# Altium project UCM Updated.PrjPcb
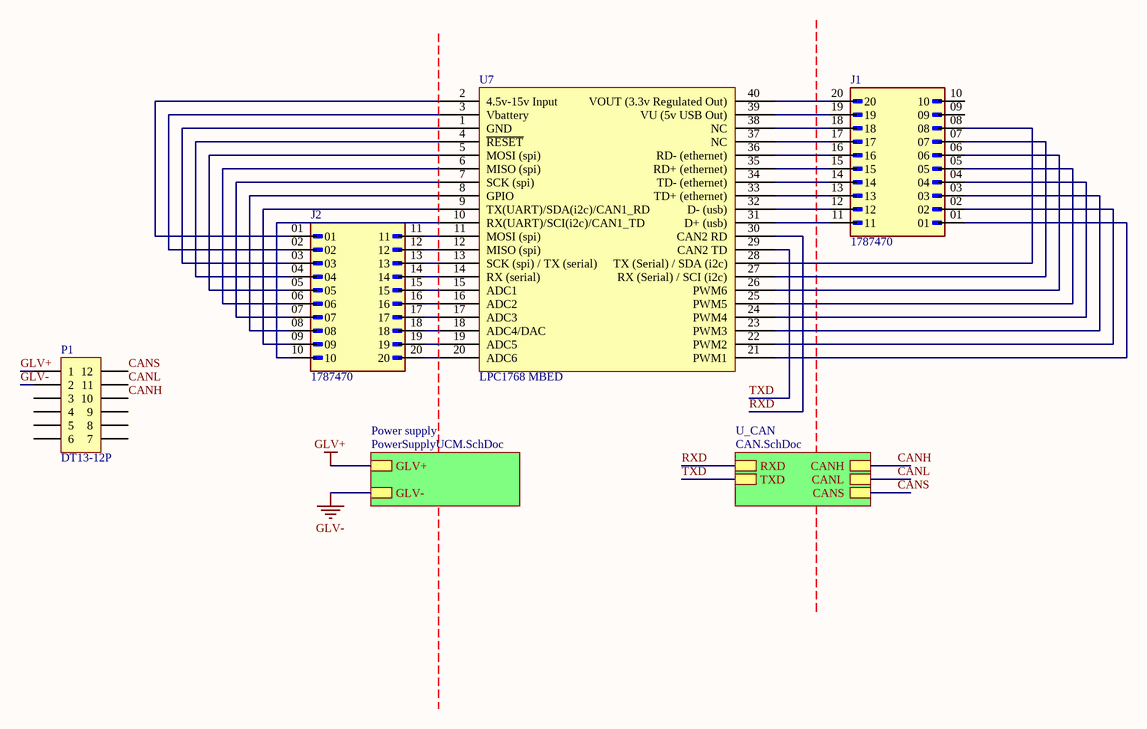
[diagram p0: toplayerUCM.SchDoc]
3 sheets, 50 parts. Net scope: hierarchical (ports join the sheet entries above them; power ports are global).
Board file: UCM update.PcbDoc
Sheets:
  toplayerUCM.SchDoc
    U_CAN = CAN.SchDoc
    Power supply = PowerSupplyUCM.SchDoc

## Sheet toplayerUCM.SchDoc
size A4; SheetNumber: 1; SheetTotal: 4

### Parts
J1  1787470  [PHOENIX_1787470]
J2  1787470  [PHOENIX_1787470]
P1  DT13-12P  [DT13-12P]
U7  LPC1768 MBED  [LPC1768 MBED]

### Sub-sheets
Power supply = PowerSupplyUCM.SchDoc: GLV+, GLV-
U_CAN = CAN.SchDoc: RXD, TXD, CANH, CANL, CANS

### Nets
GLV+: P1.1 ; sheet Power supply/GLV+
GLV-: P1.2 ; sheet Power supply/GLV-
CANH: P1.10 ; sheet U_CAN/CANH
CANL: P1.11 ; sheet U_CAN/CANL
CANS: P1.12 ; sheet U_CAN/CANS
RXD: U7.30(CAN2_RD) ; sheet U_CAN/RXD
TXD: U7.29(CAN2_TD) ; sheet U_CAN/TXD
NetJ1_01: J1.01 U7.21(PWM1)
NetJ1_02: J1.02 U7.22(PWM2)
NetJ1_03: J1.03 U7.23(PWM3)
NetJ1_04: J1.04 U7.24(PWM4)
NetJ1_05: J1.05 U7.25(PWM5)
NetJ1_06: J1.06 U7.26(PWM6)
NetJ1_07: J1.07 U7.27(RX_(Serial)_/_SCI_(i2c))
NetJ1_08: J1.08 U7.28(TX_(Serial)_/_SDA_(i2c))
NetJ1_11: J1.11 U7.31(D+_(usb))
NetJ1_12: J1.12 U7.32(D-_(usb))
NetJ1_13: J1.13 U7.33(TD+_(ethernet))
NetJ1_14: J1.14 U7.34(TD-_(ethernet))
NetJ1_15: J1.15 U7.35(RD+_(ethernet))
NetJ1_16: J1.16 U7.36(RD-_(ethernet))
NetJ1_17: J1.17 U7.37(NC)
NetJ1_18: J1.18 U7.38(NC)
NetJ1_19: J1.19 U7.39(VU_(5v_USB_Out))
NetJ1_20: J1.20 U7.40(VOUT_(3.3v_Regulated_Out))
NetJ2_01: J2.01 U7.2(4.5v-15v_Input)
NetJ2_02: J2.02 U7.3(Vbattery)
NetJ2_03: J2.03 U7.1(GND)
NetJ2_04: J2.04 U7.4(~{RESET})
NetJ2_05: J2.05 U7.5(MOSI_(spi))
NetJ2_06: J2.06 U7.6(MISO_(spi))
NetJ2_07: J2.07 U7.7(SCK_(spi))
NetJ2_08: J2.08 U7.8(GPIO)
NetJ2_09: J2.09 U7.9(TX(UART)/SDA(i2c)/CAN1_RD)
NetJ2_10: J2.10 U7.10(RX(UART)/SCI(i2c)/CAN1_TD)
NetJ2_11: J2.11 U7.11(MOSI_(spi))
NetJ2_12: J2.12 U7.12(MISO_(spi))
NetJ2_13: J2.13 U7.13(SCK_(spi)_/_TX_(serial))
NetJ2_14: J2.14 U7.14(RX_(serial))
NetJ2_15: J2.15 U7.15(ADC1)
NetJ2_16: J2.16 U7.16(ADC2)
NetJ2_17: J2.17 U7.17(ADC3)
NetJ2_18: J2.18 U7.18(ADC4/DAC)
NetJ2_19: J2.19 U7.19(ADC5)
NetJ2_20: J2.20 U7.20(ADC6)

Not connected (* = marked no-connect by the designer): J1 09 10; P1 3 4 5 6 7 8 9

### Library data of the parts
P1 = DT13-12P[[/\]]DT13-12P: Positions: 12; Pitch: 4.44mm; Row Spacing: 6.35mm; Angle: 90; Flange: Yes; Contact: Nickel; Part Number: DT13-12P; Digikey Part Number: 1734-1451-ND; Digikey Link: https://www.digikey.com.au/product-detail/en/te-connectivity-deutsch-connectors/DT13-12PA/1734-1451-ND/7220123
U7 = LPC1768 MBED: ARM M3 mBed Enabled Microcontroller; Manufacturer: NXP; Part Number: LPC1768 MBED; Digikey Part Number: 568-4916-ND; Digikey Link: https://www.digikey.com/product-detail/en/nxp-usa-inc/OM11043,598/568-4916-ND/2138502
J1 J2 = 1787470: Package: None; Price: None; Value: *; MP: 1787470; Availability: Unavailable

## Sheet CAN.SchDoc
size A4; SheetNumber: 2; SheetTotal: 3
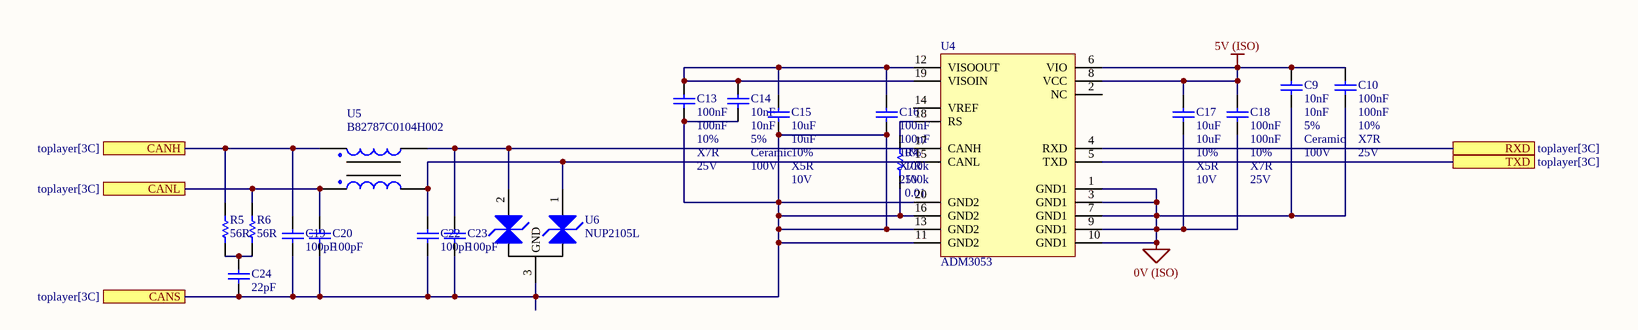
[diagram p1: CAN.SchDoc]

### Parts
C9  10nF  Tolerance: 5%  Material: Ceramic  Rated Voltage: 100V  [1206]
C10  100nF  Tolerance: 10%  Material: X7R  Rated Voltage: 25V  [0805]
C13  100nF  Tolerance: 10%  Material: X7R  Rated Voltage: 25V  [0805]
C14  10nF  Tolerance: 5%  Material: Ceramic  Rated Voltage: 100V  [1206]
C15  10uF  Tolerance: 10%  Material: X5R  Rated Voltage: 10V  [0805]
C16  100nF  Tolerance: 10%  Material: X7R  Rated Voltage: 25V  [0805]
C17  10uF  Tolerance: 10%  Material: X5R  Rated Voltage: 10V  [0805]
C18  100nF  Tolerance: 10%  Material: X7R  Rated Voltage: 25V  [0805]
C19  100pF  [0805]
C20  100pF  [0805]
C22  100pF  [0805]
C23  100pF  [0805]
C24  22pF  [0805]
R4  100k  Tolerance: 0.01  [0805]
R5  56R  [0805]
R6  56R  [0805]
U4  ADM3053  [AD SOIC-W 20]
U5  B82787C0104H002  [TDK 4-PC Pad]
U6  NUP2105L  [ON SOT-23]

### Ports
CANH (see toplayer[3C]), CANL (see toplayer[3C]), CANS (see toplayer[3C]), RXD (see toplayer[3C]), TXD (see toplayer[3C])

### Nets
0V (ISO): C9.1 C10.1 C17.1 C18.1 U4.1(GND1) U4.3(GND1) U4.7(GND1) U4.9(GND1) U4.10(GND1)
5V (ISO): C9.2 C10.2 C17.2 C18.2 U4.6(VIO) U4.8(VCC)
CANH: C19.2 R5.2 U5.1 ; port CANH
CANL: C20.2 R6.2 U5.4 ; port CANL
CANS: C13.1 C14.1 C15.1 C16.1 C19.1 C20.1 C22.1 C23.1 C24.1 R4.1 U4.11(GND2) U4.13(GND2) U4.16(GND2) U4.20(GND2) U6.3(GND) ; port CANS
RXD: U4.4(RXD) ; port RXD
TXD: U4.5(TXD) ; port TXD
NetC13_2: C13.2 C14.2 C15.2 C16.2 U4.12(VISOOUT) U4.19(VISOIN)
NetC22_2: C22.2 U4.15(CANL) U5.3 U6.1(CAN_H)
NetC23_2: C23.2 U4.17(CANH) U5.2 U6.2(CAN_L)
NetC24_2: C24.2 R5.1 R6.1
NetR4_2: R4.2 U4.18(RS)

Not connected (* = marked no-connect by the designer): U4 2(NC) 14(VREF)

### Library data of the parts
C9 C14 = GCM3195C2A103JA16D: Manufacturer: muRata; Value: 10nF; Part Number: GCM3195C2A103JA16D; Digikey Part Number: 490-4978-2-ND
C10 C13 C16 C18 = GCM21BR71E104KA37L: Manufacturer: muRata; Value: 100nF; Part Number: GCM21BR71E104KA37L
C15 C17 = GCM21BR61A106KA37L: Manufacturer: muRata; Value: 10uF; Part Number: GCM21BR61A106KA37L
C19 C20 C22 C23 = GCM21B5C1H101JA37L: Manufacturer: muRata; Tolerance: 5%; Material: C0G; Rated Voltage: 50V; Part Number: GCM21B5C1H101JA37L; Value: 100pF
C24 = GCM21B5C1H220JA37L: Manufacturer: muRata; Tolerance: 5%; Material: C0G; Rated Voltage: 50V; Part Number: GCM21B5C1H220JA37L; Value: 22pF
R4 = RC0805FR07100KL: Manufacturer: YAGEO; Rated Voltage: 0.125W; Value: 100k; Part Number: RC0805FR07100KL; Material: FR-07; qty: 50
R5 R6 = RC0805FR0756RL: Manufacturer: YAGEO; Tolerance: 0.01; Rated Voltage: 0.125W; Part Number: RC0805FR0756RL; Value: 56R; Material: FR-07; qty: 50
U4 = ADM3053: Isolated CAN Transceiver; Manufacturer: Analogue Devices; Part Number: ADM3053; Digikey Part Number: ADM3053BRWZ-ND; Digikey Link: https://www.digikey.com/product-detail/en/analog-devices-inc/ADM3053BRWZ/ADM3053BRWZ-ND/2709332
U5 = B82787C0104H002: Common mode choke intended for CANBUS 150mA 50V); Manufacturer: EPCOS (TDK); Part Number: B82787C0104H002; Digikey Part Number: 495-4598-2-ND; Digikey Link: https://www.digikey.com/product-detail/en/epcos-tdk/B82787C0104H002/495-4598-2-ND/3680998
U6 = NUP2105L: Dual Line CAN Bus Protector; Manufacturer: ON Semiconductor; Part Number: NUP2105L; Type: CAN ESD Protection; Digikey Part Number: NUP2105LT1GOSCT-ND; Digikey Link: https://www.digikey.com/product-detail/en/on-semiconductor/NUP2105LT1G/NUP2105LT1GOSCT-ND/1485001

## Sheet PowerSupplyUCM.SchDoc
size A4; SheetNumber: 3; SheetTotal: 4
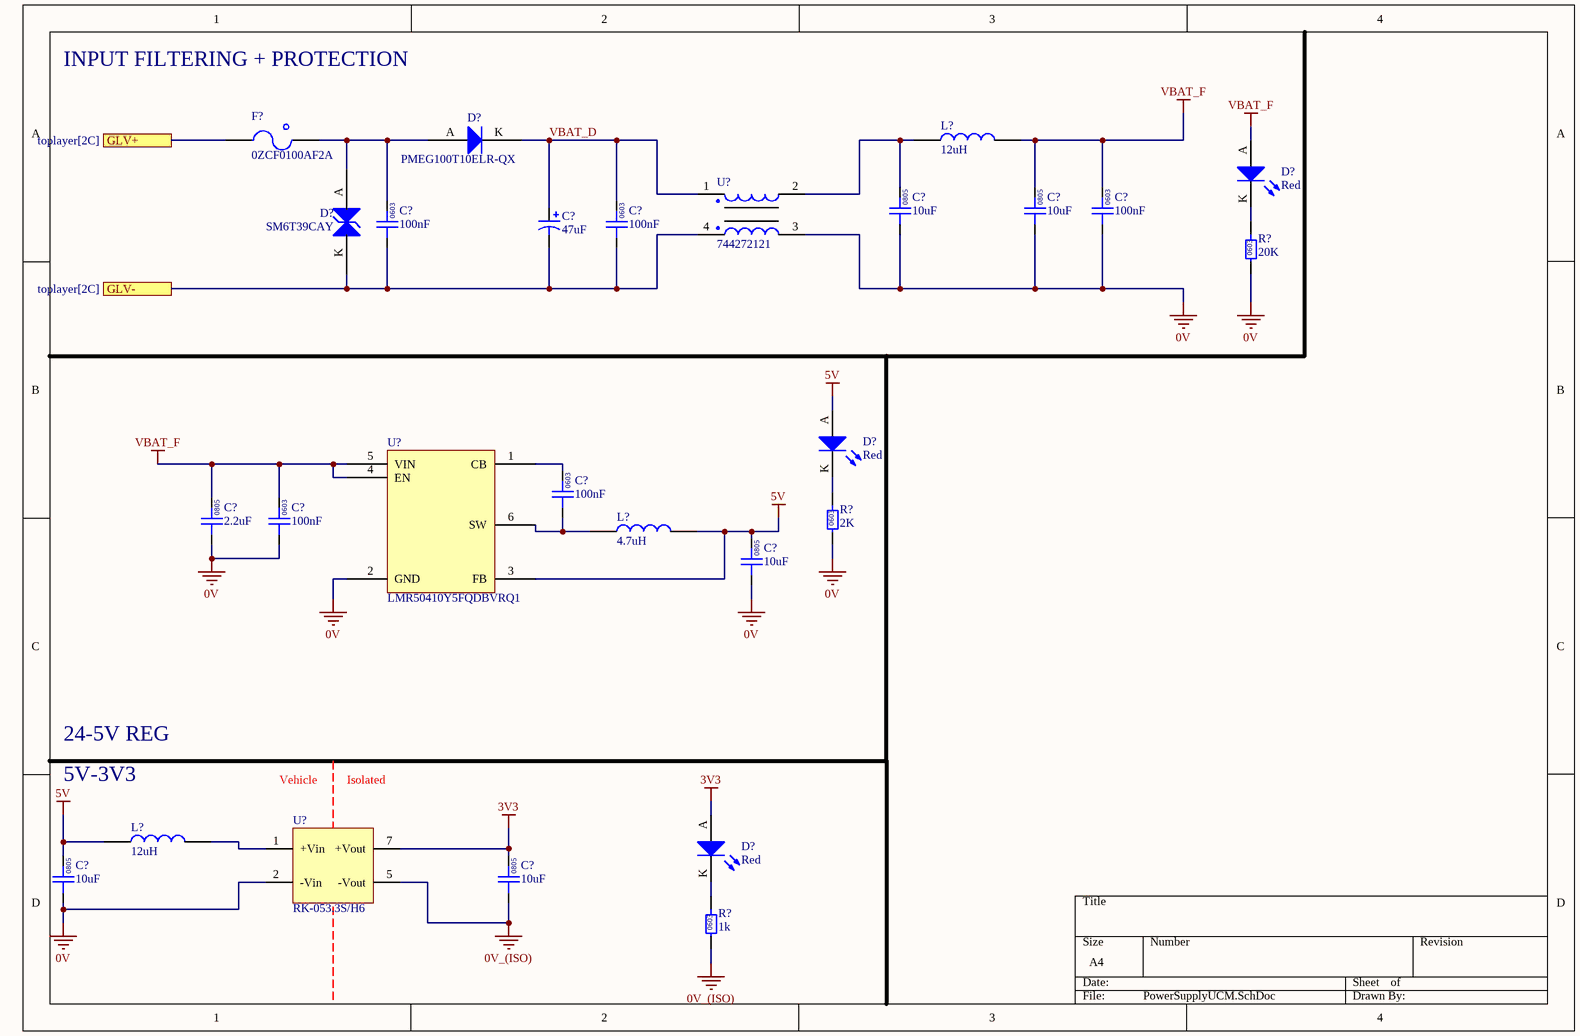
[diagram p2: PowerSupplyUCM.SchDoc]

### Parts
(Parts that share a designator on the sheet are numbered #1, #2 ... from top to bottom, then left to right.)
C?#1  47uF  [CHEMI-CON ELCO]
C?#2  10uF  [0805]
C?#3  10uF  [0805]
C?#4  100nF  [0603]
C?#5  100nF  [0603]
C?#6  100nF  [0603]
C?#7  100nF  [0603]
C?#8  2.2uF  [0805]
C?#9  100nF  [0603]
C?#10  10uF  [0805]
C?#11  10uF  [0805]
C?#12  10uF  [0805]
D?#1  PMEG100T10ELR-QX  [SODFL350X110-2N]
D?#2  Red  [0805 LED]
D?#3  SM6T39CAY  [SM6T39CAY-Footprint-1]
D?#4  Red  [0805 LED]
D?#5  Red  [0805 LED]
F?  0ZCF0100AF2A  [2920]
L?#1  12uH  [1812]
L?#2  4.7uH  [SRN3015TA-4R7M]
L?#3  12uH  [1812]
R?#1  20K  [0603]
R?#2  2K  [0603]
R?#3  1k  [0603]
U?#1  744272121  [Wurth 4-PC Pad]
U?#2  LMR50410Y5FQDBVRQ1  [TI-SOT23-6]
U?#3  RK-053.3S/H6  [RK-053.3S/H6]

### Ports
GLV+ (see toplayer[2C]), GLV- (see toplayer[2C])

### Nets
0V: C?#2.1 C?#3.1 C?#4.1 C?#8.1 C?#9.1 C?#10.1 C?#11.1 R?#1.1 R?#2.1 U?#1.3 U?#2.2(GND) U?#3.2(-Vin)
0V_(ISO): C?#12.1 R?#3.1 U?#3.5(-Vout)
3V3: C?#12.2 D?#5.A U?#3.7(+Vout)
5V: C?#10.2 C?#11.2 D?#4.A L?#2.1 L?#3.2 U?#2.3(FB)
GLV+: F?.1 ; port GLV+
GLV-: C?#1.1 C?#5.1 C?#6.1 D?#3.K U?#1.4 ; port GLV-
VBAT_F: C?#3.2 C?#4.2 C?#8.2 C?#9.2 D?#2.A L?#1.1 U?#2.4(EN) U?#2.5(VIN)
VBAT_D: C?#1.2 C?#6.2 D?#1.K U?#1.1
NetC?#2_2: C?#2.2 L?#1.2 U?#1.2
NetC?#5_2: C?#5.2 D?#1.A D?#3.A F?.2
NetC?#7_1: C?#7.1 L?#2.2 U?#2.6(SW)
NetC?#7_2: C?#7.2 U?#2.1(CB)
NetD?#2_K: D?#2.K R?#1.2
NetD?#4_K: D?#4.K R?#2.2
NetD?#5_K: D?#5.K R?#3.2
NetL?#3_1: L?#3.1 U?#3.1(+Vin)

### Notes on the sheet
- INPUT FILTERING + PROTECTION
- 24-5V REG
- 5V-3V3
- Vehicle
- Isolated
- (in symbol GCM188L81H104KA57D) 0603
- (in symbol GRM21BR6YA106KE43L) 0805
- (in symbol GRM21BR61A226ME51L) 0805
- (in symbol RC0603FR-071KL) 0603
- (in symbol RC0603FR-072KL) 0603
- (in symbol RC0603FR-0720KL) 0603

### Library data of the parts
C?#1 = HHXA350ARA470MF61G: Part Number: HHXA350ARA470MF61G
C?#2 C?#3 C?#10-C?#12 = GRM21BR6YA106KE43L: Manufacturer: muRata; Rated Voltage: 50V; Tolerance: 10%; Material: MLCC; Temperature Rating: X5R; Part Number: GRM21BR6YA106KE43L; Value: 10uF; Digikey Part Number: 490-10514-6-ND
C?#4-C?#7 C?#9 = GCM188L81H104KA57D: Manufacturer: muRata; Rated Voltage: 50V; Tolerance: ±10%; Material: MLCC; Temperature Rating: X8L; Part Number: GCM188L81H104KA57D; Value: 100nF; Digikey Part Number: 490-6049-1-ND
C?#8 = GRM21BR61A226ME51L: Manufacturer: muRata; Value: 22uF; Rated Voltage: 50V; Tolerance: 20%; Material: MLCC; Temperature Rating: X5R; Part Number: GRM21BR61A226ME51L; Digikey Part Number: 490-10511-1-ND
D?#1 = CMP-004-00005-4: Diode 100 V 1A Surface Mount SOD-123W
D?#2 D?#4 D?#5 = SML-210LTT86: Red LED Indication - Discrete 1.75V 0805 (2012 Metric); Manufacturer: ROHM Semiconductor; Part Number: SML-210LTT86; Colour: Red; Digikey Part Number: 511-1286-1-ND
D?#3 = CMP-004-00003-4: TVS Diode Single Bi-Dir 33.3V 600W Automotive 2-Pin SMB T/R / TVS DIODE 33.3VWM 69.7VC SMB; Peak Pulse Current: 57A; Polarity: Bidirectional; Min Breakdown Voltage: 37.1V; Test Current: 1mA; Number of Elements: 1; Operating Supply Voltage: 30V; Diode Type: ZENER; Clamping Voltage: 53.9V; Leakage Current: 200nA; Power Line Protection: No; Max Surge Current: 11.1A; Max Breakdown Voltage: 41V; Breakdown Voltage: 39V; Max Power Dissipation: 600W; Radiation Hardening: No; Resistor Type: Zener; Termination: SMD/SMT; REACH SVHC: No SVHC; Reverse Breakdown Voltage: 37.1V; Max Operating Temperature: 150°C; Min Operating Temperature: -55°C; Element Configuration: Single; Length: 4.6mm; Case/Package: DO-214AA; Reverse Standoff Voltage: 33.3V; Number of Bidirectional Channels: 1; Number of Pins: 2; Direction: Bidirectional; Mount: Surface Mount; Package Quantity: 1; Width: 3.95mm; RoHS Compliant: Yes; Number of Channels: 1; Packaging: Tape and Reel; Max Reverse Leakage Current: 200nA; Peak Pulse Power: 600W; Height: 2.45mm; Series: Automotive, AEC-Q101, SM6TY, TRANSIL™
F? = 0ZCF0100AF2A: PTC RESET FUSE 60V 1A 292; Manufacturer: Littelfuse Inc.; Part Number: 0ZCF0100AF2A; Digikey Part Number: 507-2070-1-ND; Digikey Link: https://www.digikey.com/product-detail/en/bel-fuse-inc/0ZCF0100AF2A/507-2070-1-ND/6210547
L?#1 L?#3 = RLS-126: Manufacturer: Recom; Tolerance: 0.2; Impedance: 230mOhm; Rated Current: 0.8 A; Material: Wirewound; Part Number: RLS-126; Value: 12uH; Digikey Part Number: 945-3429-ND
L?#2 = SRN4018-4R7M: Manufacturer: Bourns; Tolerance: 0.2; Impedance: 84mOhms; Rated Current: 1.9A; Material: Wirewound; Part Number: SRN4018-4R7M; Value: 4.7uH; Digikey Part Number: SRN3015TA-4R7MCT-ND
R?#1 = RC0603FR-0720KL: Manufacturer: YAGEO; Tolerance: 0.01; Rated Power: 0.1W; Part Number: RC0603FR-0720KL; Value: 20K; Digikey Part Number: 311-20.0KHRCT-ND; Material: FR-07
R?#2 = RC0603FR-072KL: Manufacturer: YAGEO; Tolerance: 0.01; Rated Power: 0.1W; Part Number: RC0603FR-072KL; Value: 2K; Digikey Part Number: 311-2.00KHRCT-ND; Material: FR-07
R?#3 = RC0603FR-071KL: Manufacturer: YAGEO; Tolerance: 0.01; Rated Power: 0.1W; Part Number: RC0603FR-071KL; Value: 1k; Digikey Part Number: 311-1.00KHRCT-ND; Material: FR-07
U?#1 = 744272121: Manufacturer: Wurth Electronics Inc; Value: 120uH @ 100kHz; Impedance: 460 Ohms @ 30MHz; Rated Current: 2.5 A; Part Number: 744272121; Material: Wirewound; Digikey Part Number: 732-1489-1-ND
U?#2 = LMR50410-Q1: IC REG BUCK 5V 1A SOT23-6; Manufacturer: Texas Instruments; Input Voltage: 4-36V; Part Number: LMR50410-Q1; Output Voltage: 5V; Output Current: 1A; Digikey Part Number: 296-LMR50410Y5FQDBVRQ1CT-ND
U?#3 = RK-053.3S/H6: DC DC CONVERTER 3.3V 1W; Manufacturer: Recom; Input Voltage: 5V; Output Current: 303mA; Part Number: RK-053.3S/H6; Output Voltage: 3.3V

## Nets that join several sheets
GLV+: toplayerUCM (P1.1), PowerSupplyUCM (F?.1)
GLV-: toplayerUCM (P1.2), PowerSupplyUCM (5 pins)
CANH: toplayerUCM (P1.10), CAN (C19.2 R5.2 U5.1)
CANL: toplayerUCM (P1.11), CAN (C20.2 R6.2 U5.4)
CANS: toplayerUCM (P1.12), CAN (15 pins)
RXD: toplayerUCM (U7.30), CAN (U4.4)
TXD: toplayerUCM (U7.29), CAN (U4.5)